# Altium schematic sheet Sheet1.SchDoc
size 420 x 297 mm; ENG_APP_DATE: --/--/--; DSN_APP_DATE: --/--/--; CHK_APP_DATE: --/--/--; Scale: 1:1; Разраб.: Иванов; Обозначение документа: АБВГ.123456.001 Э3; Пров.: Петров; Утв.: Сидоров; Наименование организации: ОАО "Ваша фирма"; Перв. применение: АБВГ.123456.000; Наименование изделия 1: Плата; Наименование изделия 2: Схема электрическая; Наименование изделия 3: принципиальная; Нач. отд.: Нач. отд.; Фамилия нач. отд.: Сидоров
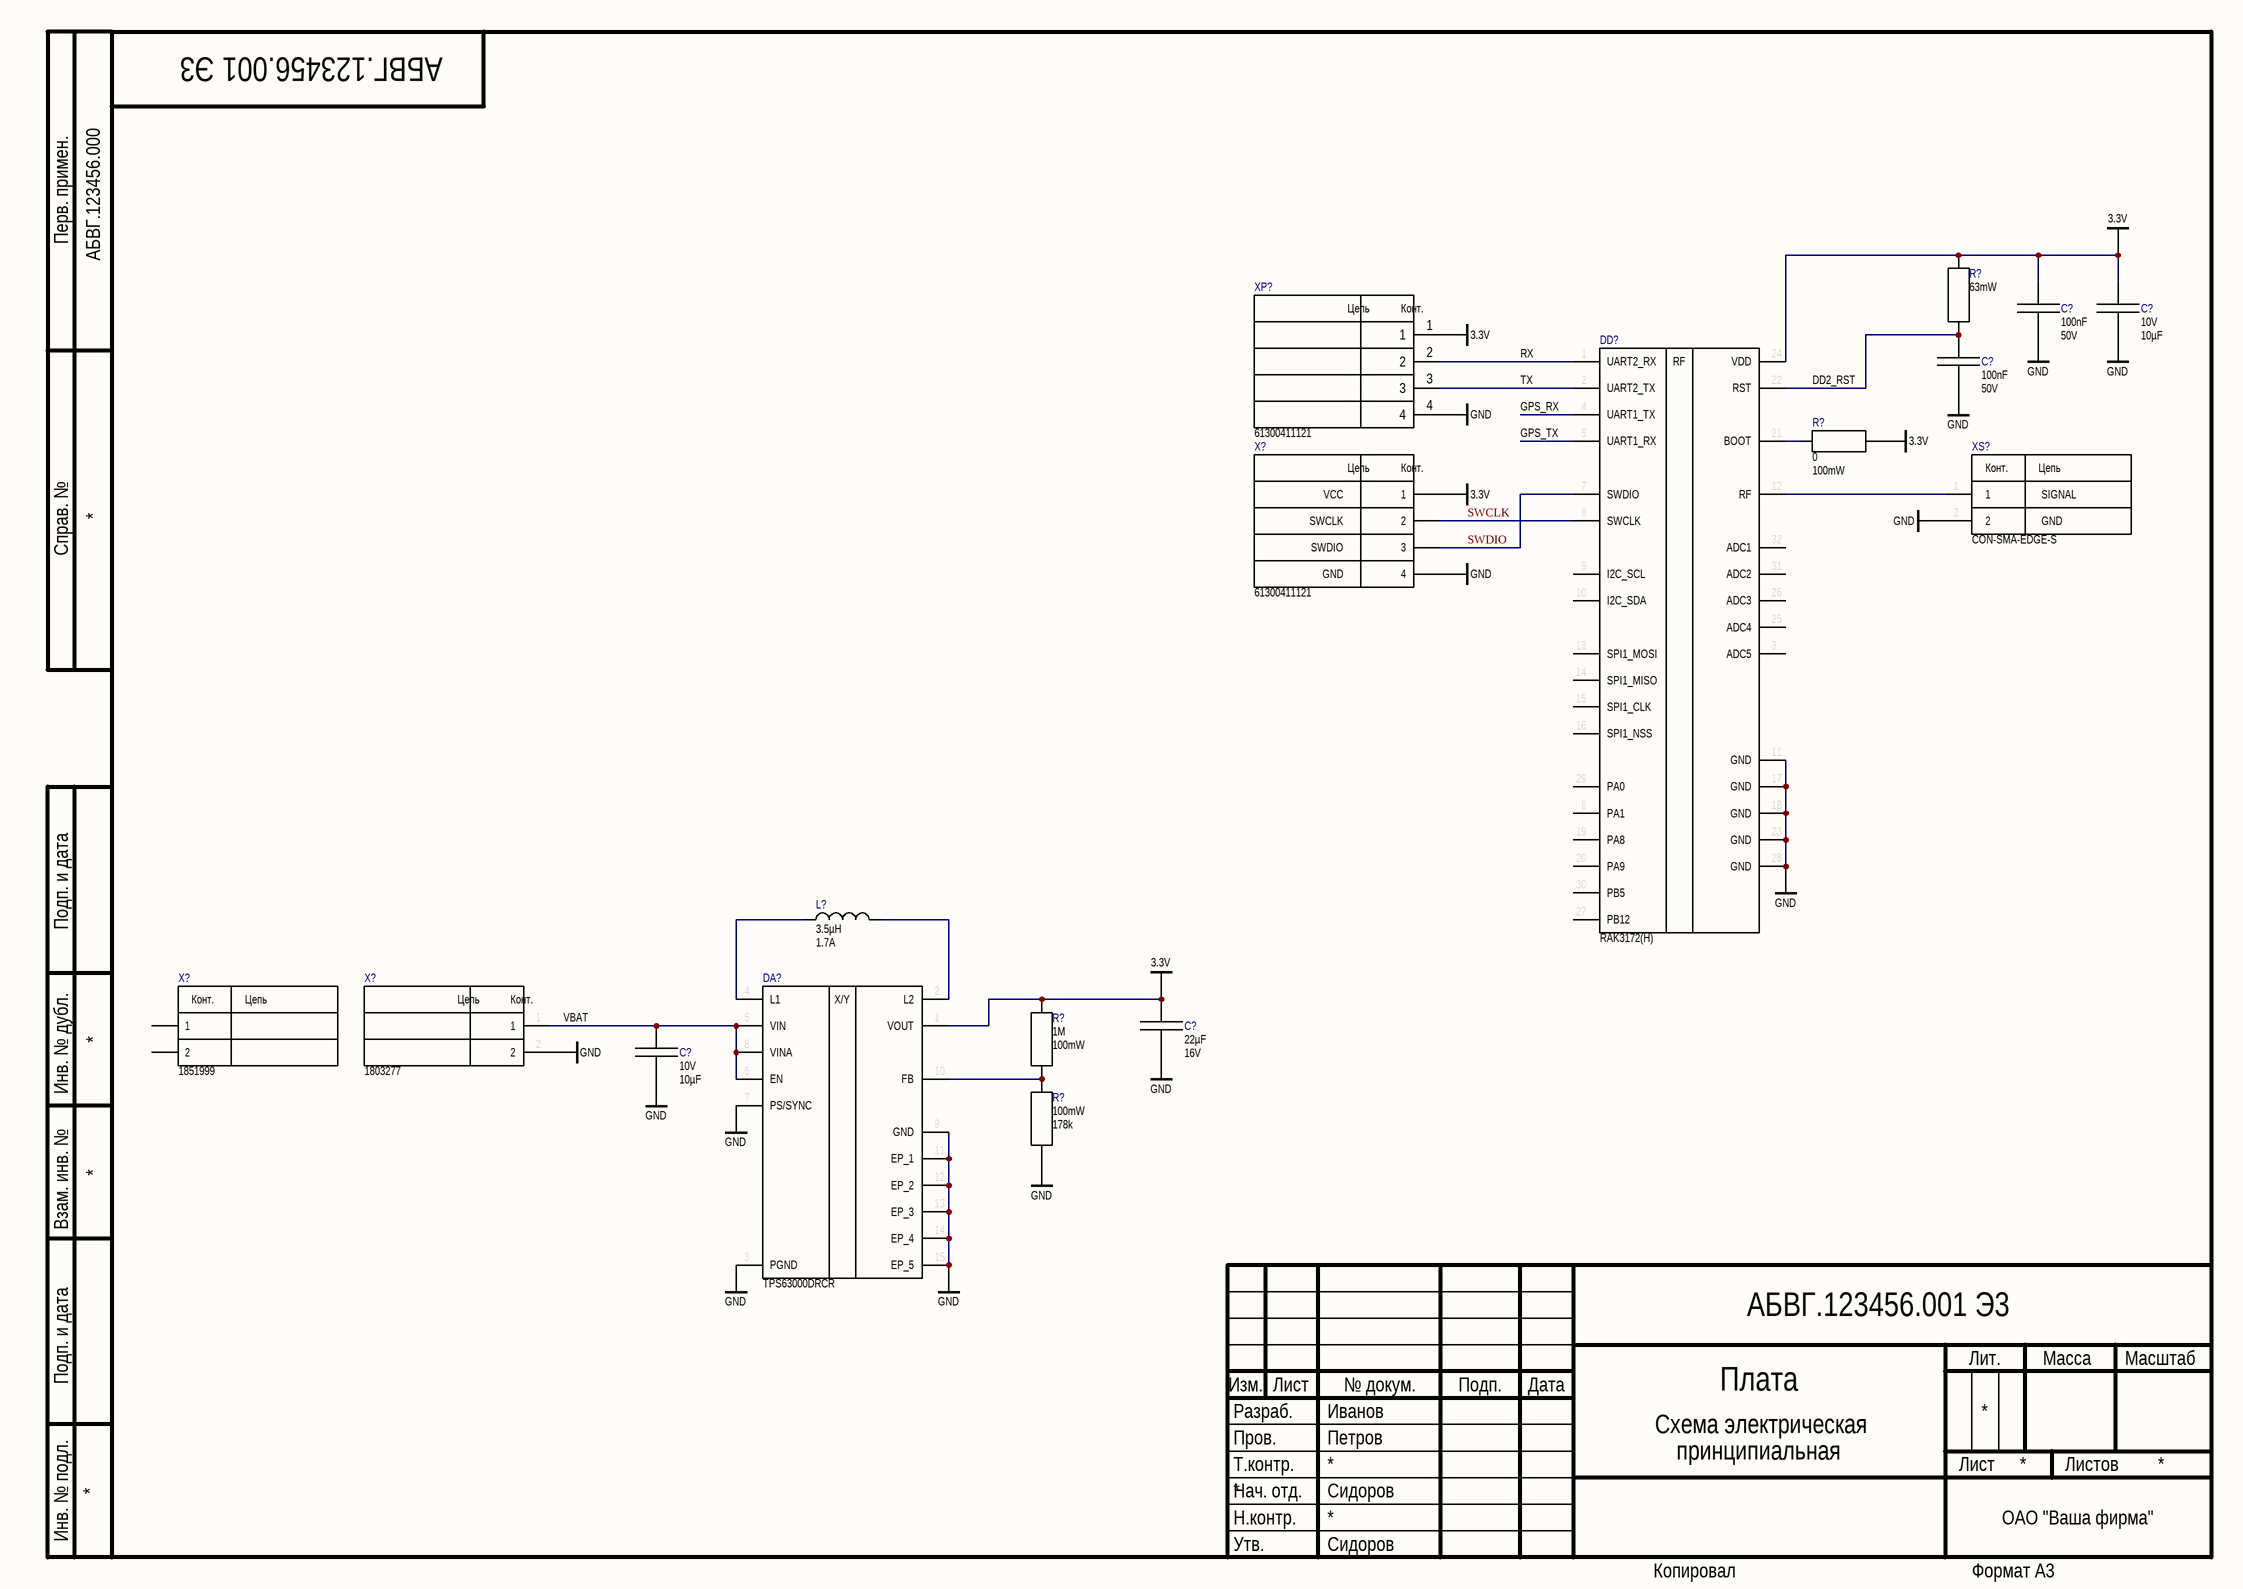
[diagram p0: Sheet1.SchDoc]

## Parts
(Parts that share a designator on the sheet are numbered #1, #2 ... from top to bottom, then left to right.)
C?#1  value 100nF  Voltage Rating: 50V  [CAPC1608X09N]  (hidden comment: GCM188R71H104KA57D)
C?#2  value 10µF  Voltage Rating: 10V  [CAPC1608X87X35ML15T15]  (hidden comment: C0603C106M8PAC7867)
C?#3  value 100nF  Voltage Rating: 50V  [CAPC1608X09N]  (hidden comment: GCM188R71H104KA57D)
C?#4  value 22µF  Voltage Rating: 16V  [CAPC2013X140X45NL15T25]  (hidden comment: C2012X5R1C226K125AC)
C?#5  value 10µF  Voltage Rating: 10V  [CAPC1608X87X35ML15T15]  (hidden comment: C0603C106M8PAC7867)
DA?  Manufacturer Part Number: TPS63000DRCR  [TPS63002DRCR]  (hidden comment: TPS63000IDRCRQ1)
DD?  RAK3172(H)  [RAK3172(H)-Footprint-1]
L?  value 3.5µH  Saturation Current: 1.7A  [SRU5018680Y]  (hidden comment: SRU5018-3R5Y)
R?#1  Power Rating: 63mW  [RESC1608X55X25LL10T15]  (hidden comment: RNCF0603BTE10K0)
R?#2  value 0  Power Rating: 100mW  [RESC1608X55X25LL10T15]  (hidden comment: RMCF0603ZT0R00)
R?#3  value 1M  Power Rating: 100mW  [RESC1608X95X40LL15T20]  (hidden comment: RMCF0603JT1M00)
R?#4  value 178k  Power Rating: 100mW  [RESC1608X95X40LL15T20]  (hidden comment: ERJ-3EKF1783V)
X?#1  Manufacturer Part Number: 61300411121  [20021311-00010T4LF-Footprint-1]  (hidden comment: ST-LINK-SWD-CONNECTOR)
X?#2  1851999
X?#3  1803277  [PHOE-1803277_V]
XP?  61300411121  [20021311-00010T4LF-Footprint-1]
XS?  CON-SMA-EDGE-S  [RFSOLUTIONS_CON-SMA-EDGE-S]

## Nets
3.3V: C?#1.2 C?#2.2 C?#4.2 DA?.1(VOUT) DD?.24(VDD) R?#1.1 R?#2.2 R?#3.2 X?#1.1(VCC) XP?.1
GND: C?#1.1 C?#2.1 C?#3.1 C?#4.1 C?#5.1 DA?.3(PGND) DA?.7(PS/SYNC) DA?.9(GND) DA?.11(EP_1) DA?.12(EP_2) DA?.13(EP_3) DA?.14(EP_4) DA?.15(EP_5) DD?.11(GND) DD?.17(GND) DD?.18(GND) DD?.23(GND) DD?.28(GND) R?#4.1 X?#1.4(GND) X?#3.2 XP?.4 XS?.2(GND)
DD2_RST: C?#3.2 DD?.22(RST) R?#1.2
GPS_RX: DD?.4(UART1_TX)
GPS_TX: DD?.5(UART1_RX)
RX: DD?.1(UART2_RX) XP?.2
SWCLK: DD?.8(SWCLK) X?#1.2(SWCLK)
SWDIO: DD?.7(SWDIO) X?#1.3(SWDIO)
TX: DD?.2(UART2_TX) XP?.3
VBAT: C?#5.2 DA?.5(VIN) DA?.6(EN) DA?.8(VINA) X?#3.1
NetDA?_2: DA?.2(L2) L?.2
NetDA?_4: DA?.4(L1) L?.1
NetDA?_10: DA?.10(FB) R?#3.1 R?#4.2
NetDD?_12: DD?.12(RF) XS?.1(SIGNAL)
NetDD?_21: DD?.21(BOOT) R?#2.1

Not connected (* = marked no-connect by the designer): DD? 3(ADC5) 6(PA1) 9(I2C_SCL) 10(I2C_SDA) 13(SPI1_MOSI) 14(SPI1_MISO) 15(SPI1_CLK) 16(SPI1_NSS) 19(PA8) 20(PA9) 25(ADC4) 26(ADC3) 27(PB12) 29(PA0) 30(PB5) 31(ADC2) 32(ADC1); X?#2 1 2

## Notes on the sheet
- Перв. примен.
- Справ. №
- Подп. и дата
- Инв. № дубл.
- Взам. инв. №
- Разраб.
- Изм.
- Лист
- № докум.
- Подп.
- Дата
- Лит.
- Масса
- Масштаб
- Пров.
- Т.контр.
- Листов
- Инв. № подл.
- Утв.
- Н.контр.
- Копировал
- Формат А3
- (in symbol CMP-002-00014-7) Цепь; Конт.
- (in symbol CMP-002-00086-2) Конт.; Цепь
- (in symbol CMP-002-00091-3) Цепь; Конт.
- (in symbol CMP-002-00092-3) Цепь; Конт.
- (in symbol CMP-002-00106-1) Конт.; Цепь
- (in symbol CMP-031-00015-3) X/Y

## Library data of the parts
C?#1 C?#3 = CMP-001-00128-5: CAP CER 0.1UF 50V X7R 0603; Manufacturer: Murata; Tolerance: 10%; Approvals: CSA,UR; Color: Grey; RoHS Compliant: Yes; Case/Package: 0603; Max Operating Temperature: 125°C; Min Operating Temperature: -55°C; Case Code (Metric): 1608; Depth: 0.8mm; Dielectric: X7R; Height: 0.8mm; Length: 1.6mm; Mount: Surface Mount; Package Quantity: 1; Packaging: Tape and Reel; Radiation Hardening: No; Series: GCM; Termination: SMD/SMT; Thickness: 0.035inch; Width: 0.031inch; Manufacturer Part Number: GCM188R71H104KA57D; Lead Free: Lead Free; REACH SVHC: No SVHC; Voltage: 50V; ComponentLink1Description: https://datasheet.ciiva.com/16624/product-16624562.pdf?src-supplier=Avnet+Europe; ComponentLink1URL: https://datasheet.ciiva.com/16624/product-16624562.pdf?src-supplier=Avnet+Europe; ComponentLink2Description: https://datasheet.ciiva.com/133/product-133574.pdf?src-supplier=Digi-Key; ComponentLink2URL: https://datasheet.ciiva.com/133/product-133574.pdf?src-supplier=Digi-Key; ComponentLink3Description: https://datasheet.ciiva.com/133/product-133575.pdf?src-supplier=Digi-Key; ComponentLink3URL: https://datasheet.ciiva.com/133/product-133575.pdf?src-supplier=Digi-Key; ComponentLink4Description: https://datasheet.ciiva.com/18183/getdatasheetpartid-98693-18183626.pdf?src-supplier=Verical; ComponentLink4URL: https://datasheet.ciiva.com/18183/getdatasheetpartid-98693-18183626.pdf?src-supplier=Verical; ComponentLink5Description: https://datasheet.ciiva.com/11786/0900766b80ef92d0-11786863.pdf?src-supplier=RSComponents; ComponentLink5URL: https://datasheet.ciiva.com/11786/0900766b80ef92d0-11786863.pdf?src-supplier=RSComponents; ComponentLink6Description: https://datasheet.ciiva.com/133/product-133573.pdf?src-supplier=Digi-Key; ComponentLink6URL: https://datasheet.ciiva.com/133/product-133573.pdf?src-supplier=Digi-Key; ComponentLink7Description: https://datasheet.ciiva.com/2989/product-2989242.pdf?src-supplier=Avnet; ComponentLink7URL: https://datasheet.ciiva.com/2989/product-2989242.pdf?src-supplier=Avnet; ComponentLink8Description: https://datasheet.ciiva.com/16497/product-16497247.pdf?src-supplier=Future+Electronics; ComponentLink8URL: https://datasheet.ciiva.com/16497/product-16497247.pdf?src-supplier=Future+Electronics; Construction: Flat; Design Item ID: 1_16; Pricing 1: 1=0,11000, 10=0,07900, 50=0,04280, 100=0,03500, 500=0,02502, 1000=0,01966 (USD); Ratings: AEC-Q200; RoHS: Yes; Source: Meteo_1.SCHLIB; Stock 1: 4755830; Voltage Rating (DC): 50V
C?#2 C?#5 = CMP-009-00284-2: Cap Ceramic 10uF 10V X5R 20% SMD 0603 85°C Paper T/R; Manufacturer: KEMET; Mounting Technology: SMT; Tolerance: 20%; Pins: 2; RoHS Compliant: Yes; Case/Package: 0603; Min Operating Temperature: -55°C; Max Operating Temperature: 85°C; Mount: Surface Mount; Case Code (Imperial): 0603; Packaging: Cut Tape; Case Code (Metric): 1608; Capacitance: 10uF; Manufacturer Part Number: C0603C106M8PAC7867
C?#4 = CMP-001-00144-1: TDK - C2012X5R1C226K125AC - SMD Multilayer Ceramic Capacitor, 22 µF, 16 V, 0805 [2012 Metric], ± 10%, X5R, C Series; Capacitance: 22uF; Case/Package: 0805; RoHS Compliant: Yes; Min Operating Temperature: -55°C; Tolerance: 10%; Max Operating Temperature: 85°C; Manufacturer Part Number: C2012X5R1C226K125AC; Series: C; Thickness: 0.057inch; Manufacturer: TDK; Case Code (Imperial): 0805; Mount: Surface Mount; Case Code (Metric): 2012; Termination: Wraparound; Packaging: Tape and Reel; Width: 0.049inch; Length: 2mm; Dielectric: X5R; Construction: Flat; Depth: 1.25mm; Package Quantity: 1; Dielectric Material: Ceramic; Height: 1.25mm; Lead Free: Lead Free; Number of Pins: 2; REACH SVHC: No SVHC; Resistor Type: Ceramic; Voltage: 16V; Voltage Rating (DC): 16V; Weight: 0.000194oz
DA? = CMP-031-00015-3: IC REG BUCK BOOST ADJ 1.6A 10SON; Manufacturer: Texas Instruments; Max Input Voltage: 5.5V; Topology: Buck-Boost; Min Output Voltage: 1.2V; Quiescent Current: 40uA; Output Type: Adjustable; Number of Outputs: 1; Synchronous Rectifier: Yes; Max Output Current: 1.2A; Min Input Voltage: 1.8V; Output Configuration: Positive; Efficiency: 96%; Switching Frequency: 1.5MHz; Min Operating Temperature: -40°C; Output Current: 1.6A; Max Output Voltage: 5.5V; Output Voltage: 5.5V; Weight: 0.000921oz; Series: Automotive, AEC-Q100; Max Operating Temperature: 85°C; Contact Plating: Gold; Number of Pins: 10; Width: 3mm; Operating Supply Voltage: 5.5V; Packaging: Tape and Reel; RoHS Compliant: Yes; Package Quantity: 1; Lead Free: Lead Free; Case/Package: VSON
DD? = CMP-00025-00003-1: RAK3172 WisDuo LPWAN Module; Manufacturer: RAK Wireless; Manufacturer Part Number: RAK3172(H)
L? = CMP-006-00039-2: Ind Power Shielded Wirewound 3.5uH 30% 100KHz 9Q-Factor Ferrite 2.1A T/R; Manufacturer: Bourns; Self Resonant Frequency: 90MHz; Q Factor: 9; DC Resistance (DCR): 32mR; DC Current: 2.1A; Height: 1.8mm; Packaging: Tape and Reel; Tolerance: 30%; Series: SRU5018; Core Material: Ferrite; Inductance: 3.5uH; Current Rating: 2.1A; Length: 5.2mm; Termination: SMD/SMT; Test Frequency: 100kHz; Shielding: Shielded; Number of Pins: 2; RoHS Compliant: Yes; Case/Package: 5018; Max DC Current: 2.1A; Military Standard: Not; Min Operating Temperature: -40°C; Mount: Surface Mount; Width: 0.205inch; Package Quantity: 1000; Max Operating Temperature: 125°C; Depth: 5.4mm; Manufacturer Part Number: SRU5018-3R5Y
R?#1 = CMP-009-00270-2: RES 10K OHM 0.1% 1/10W 0603; Max Power Dissipation: 100mW; Voltage Rating: 75V; Component Comment: 10k 63mW; Temperature Coefficient: 25ppm/°C; Radiation Hardening: No; Length: 0.063inch; Series: RNCF; Resistor Type: Thin Film; Lead Free: Lead Free; Resistance: 10k; Packaging: Tape and Reel; Max Operating Temperature: 155°C; Case Code (Metric): 1608; Contact Plating: Tin,Matte; Width: 0.031inch; Size Code: 0603; RoHS Compliant: Yes; Height: 0.022inch; Number of Terminations: 2; Package Quantity: 5000; Tolerance: 0.1%; Pins: 2; Mount: Surface Mount; Min Operating Temperature: -55°C; Case/Package: 0603; Case Code (Imperial): 0603; Features: Moisture Resistant
R?#2 = CMP-009-00251-4: Res Thkflm 0603 0 Ohm Jumper 1/10W 100Ppm/ C Smd Rohs Compliant: Yes; Manufacturer: Stackpole Electronics Inc; Current Rating: 1A; Working Voltage: 75V; Component Comment: 0 100mW; Min Operating Temperature: -55°C; Length: 1.55mm; Resistance: 0; Mount: Surface Mount; Max Operating Temperature: 155°C; Height: 0.022inch; RoHS Compliant: Yes; Radiation Hardening: No; Case Code (Metric): 1608; Contact Plating: Tin,Matte; Width: 0.031inch; Resistor Type: Thick Film; Construction: Rectangular; Military Standard: Not; Lead Free: Lead Free; Depth: 0.8mm; Case Code (Imperial): 0603; Number of Terminations: 2; Series: RMCF; Max Power Dissipation: 100mW; Packaging: Tape and Reel; Features: Automotive AEC-Q200; Case/Package: 0603; Manufacturer Part Number: RMCF0603ZT0R00
R?#3 = CMP-00024-2: RES 1M OHM 5% 1/10W 0603; Manufacturer: Stackpole Electronics; Working Voltage: 75V; Component Comment: 1M 100mW; Temperature Coefficient: 200ppm/°C; Radiation Hardening: No; Width: 0.031inch; Tolerance: 5%; Case Code (Metric): 1608; Mount: Surface Mount; Number of Terminations: 2; Construction: Rectangular; Military Standard: Not; Resistor Type: Thick Film; Height: 0.022inch; Max Power Dissipation: 100mW; Series: RMCF; Contact Plating: Tin,Matte; Case Code (Imperial): 0603; Max Operating Temperature: 155°C; Resistance: 1M; Depth: 0.8mm; Lead Free: Lead Free; Min Operating Temperature: -55°C; Length: 1.55mm; Technology: THICK FILM; Case/Package: 0603; Features: Automotive AEC-Q200; Packaging: Tape and Reel; RoHS Compliant: Yes; Manufacturer Part Number: RMCF0603JT1M00
R?#4 = CMP-00025-2: ICK FILM, RESISTOR, 178KOHM, 100mW, ±1%; Product Range:PANASONIC - ERJ Series; Resistance:178kohm; Power Rating:100mW; Resistance Tolerance:± 1%; Resistor Case Style:0603 ^1608 Metric]; Resistor Element Type:Thick Film; MSL:-; Voltage Rating (DC): 50V; Component Comment: 178k 100mW; Temperature Coefficient: 100ppm/°C; Voltage Rating: 75V; Resistance: 178k; Depth: 0.8mm; Width: 0.8mm; Construction: Rectangular; Lead Free: Lead Free; REACH SVHC: No SVHC; Termination: SMD/SMT; Series: ERJ; Number of Terminations: 2; Case Code (Metric): 1608; Technology: THICK FILM; Resistance Tolerance: 1%; Military Standard: Not; Min Operating Temperature: -55°C; Max Operating Temperature: 155°C; Case/Package: 0603; Features: Automotive AEC-Q200; Length: 1.6mm; Package Quantity: 1; Case Code (Imperial): 0603; Tolerance: 1%; Packaging: Tape and Reel; Resistor Type: Thick Film; Max Power Dissipation: 100mW; Contact Plating: Tin; Mount: Surface Mount; Height: 0.45mm; RoHS Compliant: Yes; Manufacturer Part Number: ERJ-3EKF1783V; Manufacturer: Panasonic
X?#1 = CMP-002-00091-3: Conn Unshrouded Header HDR 4 POS 2.54mm Solder ST Thru-Hole Bag; Manufacturer: Würth Elektronik; Position: 4; Pitch: 0.1inch; Connector Type: Male Pin; Gender: Male; Number of Rows: 1; Color: Black; REACH SVHC: Unknown; Contact Material: Copper; Mount: Through Hole; Contact Plating: Gold; Contact Mating Length: 0.236inch; Number of Contacts: 4; Lead Free: Lead Free; Number of Positions: 4; RoHS Compliant: Yes; Pins: 4; Packaging: Bulk; Termination: Solder
X?#2 = CMP-002-00106-1: Pluggable Terminal Blocks 2 Pos 3.81mm pitch Plug 28-16 AWG Screw; Manufacturer: Phoenix Contact; Number of Contacts: 2; Wire Gauge (Min): 14AWG; Gender: Female; Voltage Rating: 160V; Current: 8A; Wire Gauge (Max): 30AWG; Number of Levels: 1; Voltage: 300V; Color: Green; Number of Rows: 1; Number of Positions: 2; Manufacturer Part Number: 1851999; Pitch: 3.81mm; Housing Color: Green; Height: 11.1mm; Number of Circuits: 2; Mount: Free Hanging,Cable; Packaging: Bulk; Pins: 2; Series: COMBICON MC; Termination: Screw; Number of Positions Per Level: 2; Contact Material: Gold; Package Quantity: 50; Length: 3.81mm; Housing Material: Plastic; Connector Type: Screw; Orientation: Straight; Contact Plating: Gold; Depth: 11.1mm; Material: Polyamide; Width: 16.1mm; Current Rating: 8A; Flammability Rating: UL94 V-0; Max Current Rating: 8A; Weight: 0.053969oz
X?#3 = CMP-002-00014-7: Male Header, Pitch 3.81 mm, 1 x 2 Position, Height 7.25 mm, Tail Length 3.4 mm, RoHS, Bulk; Manufacturer: Phoenix Contact; Rows: 1; Voltage Rating: 160V; Current Rating: 8A; Mounting Technology: TH; Contact Plating: Tin; Datasheet Version: Feb-14; Gender: Male; Connector Type: Header; Pins: 2; RoHS Compliant: True; Case/Package: 1803277; Package Description: Male Header, Pitch 3.81 mm, 1 x 2 Position, Height 7.25 mm, Tail Length 3.4 mm; Manufacturer Part Number: 1803277; Datasheet URL: https://datasheet.ciiva.com/16096/1803277-16096845.pdf; Diameter: 7.25mm; Package Quantity: 50; Packaging: Bulk; Lead Pitch: 0.15inch; Colour: Green; Package Reference: 1803277
XP? = CMP-002-00092-3: Conn Unshrouded Header HDR 4 POS 2.54mm Solder ST Thru-Hole Bag; Manufacturer: Würth Elektronik; Position: 4; Connector Type: Male Pin; Gender: Male; Pitch: 0.1inch; Number of Rows: 1; Number of Positions: 4; Contact Mating Length: 0.236inch; Color: Black; Contact Material: Copper; Lead Free: Lead Free; RoHS Compliant: Yes; Packaging: Bulk; Mount: Through Hole; Number of Contacts: 4; REACH SVHC: Unknown; Contact Plating: Gold; Termination: Solder; Pins: 4; Manufacturer Part Number: 61300411121
XS? = CMP-002-00086-2: CONN SMA JACK STR EDGE MNT; Manufacturer: RF Solutions; Connector Type: SMA,Socket; Number of Ports: 1; Termination: Solder; Pins: 3; Package Quantity: 1; Mount: Edge; Case/Package: SMA; Manufacturer Part Number: CON-SMA-EDGE-S; Fastening Type: Threaded